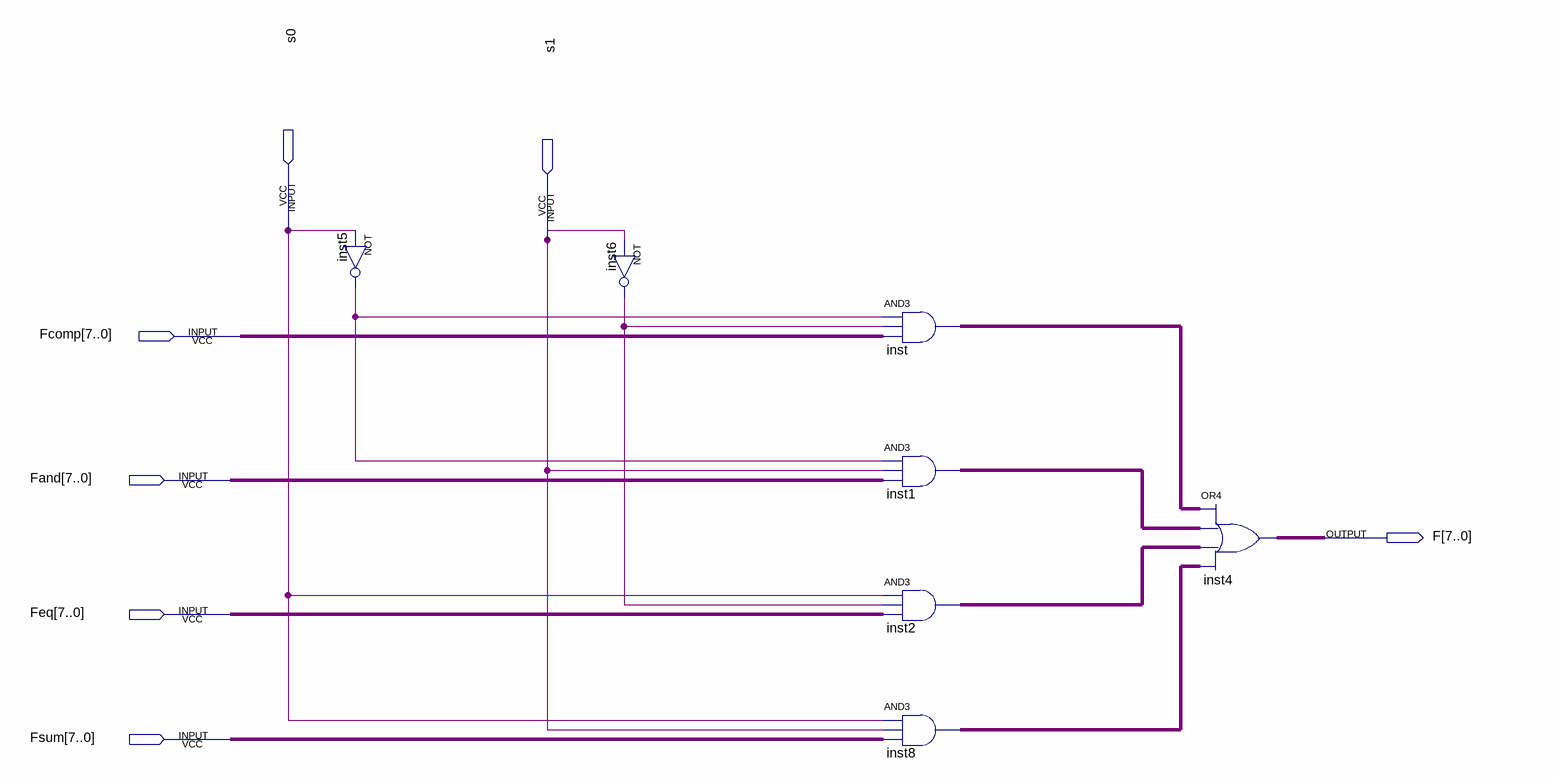
[diagram p0: schematic sheet]
// Quartus schematic Lab2.bdf as structural Verilog: 7 symbols, 7 pins
module Lab2 (
  input  s0,
  input  s1,
  input  [7:0] Fcomp,
  input  [7:0] Fand,
  input  [7:0] Feq,
  input  [7:0] Fsum,
  output [7:0] F
);

  wire inst5_out, inst6_out;
  wire [7:0] inst1_out, inst2_out, inst8_out, inst_out;

  not inst5 (inst5_out, s0);
  not inst6 (inst6_out, s1);
  assign inst_out = {8{inst5_out}} & {8{inst6_out}} & Fcomp;  // AND3 inst, 8 bits wide
  assign inst1_out = {8{inst5_out}} & {8{s1}} & Fand;  // AND3 inst1, 8 bits wide
  assign inst2_out = {8{s0}} & {8{inst6_out}} & Feq;  // AND3 inst2, 8 bits wide
  assign inst8_out = {8{s0}} & {8{s1}} & Fsum;  // AND3 inst8, 8 bits wide
  assign F = inst_out | inst1_out | inst2_out | inst8_out;  // OR4 inst4, 8 bits wide
endmodule
